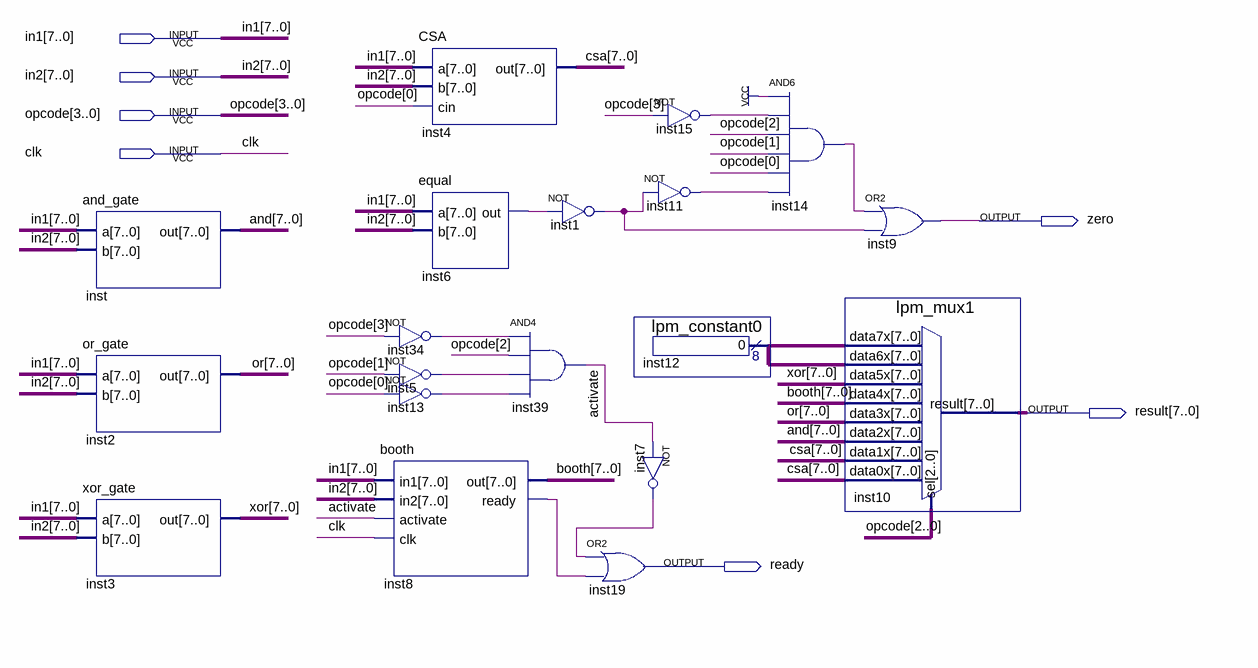
[diagram p0: schematic sheet]
// Quartus schematic ALU.bdf as structural Verilog: 19 symbols, 7 pins
module ALU (
  input  [7:0] in1,
  input  [7:0] in2,
  input  [3:0] opcode,
  input  clk,
  output zero,
  output [7:0] result,
  output ready
);

  wire activate, inst1_out, inst5_out, inst6_out, inst7_out, inst8_ready, inst11_out, inst13_out, inst14_out,
       inst15_out, inst34_out;
  wire [7:0] \and , booth, csa, inst12_result, \or , \xor ;

  and_gate inst (.a(in1), .b(in2), .out(\and ));
  or_gate inst2 (.a(in1), .b(in2), .out(\or ));
  xor_gate inst3 (.a(in1), .b(in2), .out(\xor ));
  CSA inst4 (.a(in1), .b(in2), .cin(opcode[0]), .out(csa));
  equal inst6 (.a(in1), .b(in2), .out(inst6_out));
  not inst34 (inst34_out, opcode[3]);
  not inst5 (inst5_out, opcode[1]);
  not inst13 (inst13_out, opcode[0]);
  booth inst8 (.in1(in1), .in2(in2), .activate(activate), .clk(clk), .out(booth), .ready(inst8_ready));
  not inst1 (inst1_out, inst6_out);
  and inst39 (activate, inst34_out, opcode[2], inst5_out, inst13_out);
  not inst15 (inst15_out, opcode[3]);
  not inst11 (inst11_out, inst1_out);
  lpm_constant0 inst12 (.result(inst12_result));
  not inst7 (inst7_out, activate);
  or inst19 (ready, inst7_out, inst8_ready);
  and inst14 (inst14_out, 1'b1, inst15_out, opcode[2], opcode[1], opcode[0], inst11_out);
  or inst9 (zero, inst14_out, inst1_out);
  lpm_mux1 inst10 (
    .data7x(inst12_result), .data6x(inst12_result), .data5x(\xor ), .data4x(booth), .data3x(\or ),
    .data2x(\and ), .data1x(csa), .data0x(csa), .sel(opcode[2:0]), .result(result));
endmodule
